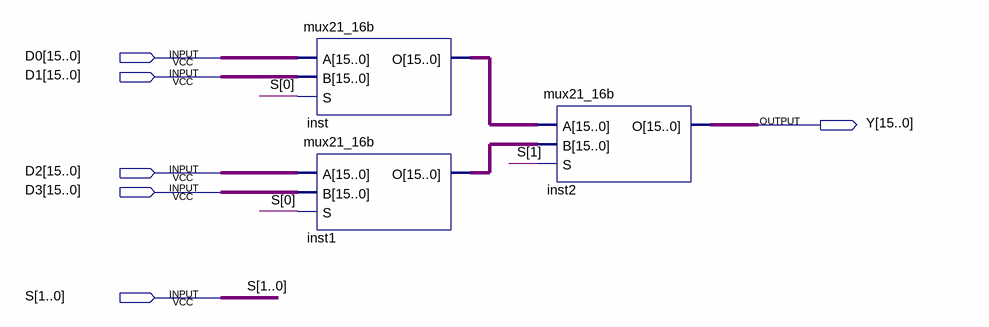
[diagram p0: schematic sheet]
// Quartus schematic mux41_16b.bdf as structural Verilog: 3 symbols, 6 pins
module mux41_16b (
  input  [15:0] D0,
  input  [15:0] D1,
  input  [15:0] D2,
  input  [15:0] D3,
  input  [1:0] S,
  output [15:0] Y
);

  wire [15:0] inst1_o, inst_o;

  mux21_16b inst (.A(D0), .B(D1), .S(S[0]), .O(inst_o));
  mux21_16b inst1 (.A(D2), .B(D3), .S(S[0]), .O(inst1_o));
  mux21_16b inst2 (.A(inst_o), .B(inst1_o), .S(S[1]), .O(Y));
endmodule
